# Altium schematic sheet STAC_Test_Board_v1_QSPI.SchDoc: STAC Quad-SPI Peripherals
size B; DrawnBy: Rahul Kumar; Revision: X1; SheetNumber: 4; SheetTotal: 5
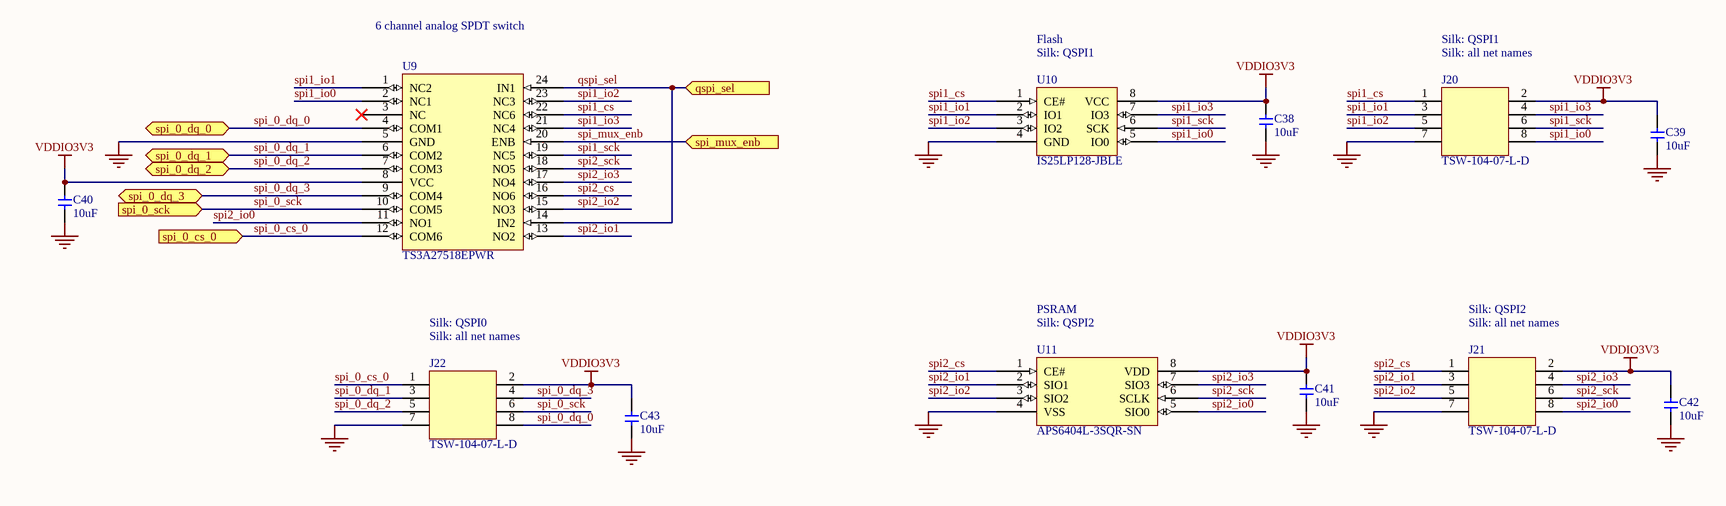
[diagram p0: STAC_Test_Board_v1_QSPI.SchDoc]

## Parts
C38  10uF  [0603]
C39  10uF  [0603]
C40  10uF  [0603]
C41  10uF  [0603]
C42  10uF  [0603]
C43  10uF  [0603]
J20  TSW-104-07-L-D  [CON-008-100-400X200/2X4-POST]
J21  TSW-104-07-L-D  [CON-008-100-400X200/2X4-POST]
J22  TSW-104-07-L-D  [CON-008-100-400X200/2X4-POST]
U9  TS3A27518EPWR  [GW-24-.65-6.4]
U10  IS25LP128-JBLE  [GW-08-1.27-5.2X8.0]
U11  APS6404L-3SQR-SN  [GW-08-1.27-5.0X6.0]

## Ports
qspi_sel (in, see STAC_Test_Board_v1[3C], STAC_Test_Board_v1_SwitchesButtons[6C]), spi_0_cs_0 (in, see STAC_Test_Board_v1[3C]), spi_0_dq_0 (bidir, see STAC_Test_Board_v1[3C]), spi_0_dq_1 (bidir, see STAC_Test_Board_v1[3C]), spi_0_dq_2 (bidir, see STAC_Test_Board_v1[3C]), spi_0_dq_3 (bidir, see STAC_Test_Board_v1[3C]), spi_0_sck (in, see STAC_Test_Board_v1[3C]), spi_mux_enb (in, see STAC_Test_Board_v1[3C], STAC_Test_Board_v1_SwitchesButtons[6C])

## Nets
GND: C38.2 C39.2 C40.2 C41.2 C42.2 C43.2 J20.7 J21.7 J22.7 U9.5(GND) U10.4(GND) U11.4(VSS)
VDDIO3V3: C38.1 C39.1 C40.1 C41.1 C42.1 C43.1 J20.2 J21.2 J22.2 U9.8(VCC) U10.8(VCC) U11.8(VDD)
qspi_sel: U9.14(IN2) U9.24(IN1) ; port qspi_sel
spi1_cs: J20.1 U9.22(NC6) U10.1(CE#)
spi1_io0: J20.8 U9.2(NC1) U10.5(IO0)
spi1_io1: J20.3 U9.1(NC2) U10.2(IO1)
spi1_io2: J20.5 U9.23(NC3) U10.3(IO2)
spi1_io3: J20.4 U9.21(NC4) U10.7(IO3)
spi1_sck: J20.6 U9.19(NC5) U10.6(SCK)
spi2_cs: J21.1 U9.16(NO6) U11.1(CE#)
spi2_io0: J21.8 U9.11(NO1) U11.5(SIO0)
spi2_io1: J21.3 U9.13(NO2) U11.2(SIO1)
spi2_io2: J21.5 U9.15(NO3) U11.3(SIO2)
spi2_io3: J21.4 U9.17(NO4) U11.7(SIO3)
spi2_sck: J21.6 U9.18(NO5) U11.6(SCLK)
spi_0_cs_0: J22.1 U9.12(COM6) ; port spi_0_cs_0
spi_0_dq_0: J22.8 U9.4(COM1) ; port spi_0_dq_0
spi_0_dq_1: J22.3 U9.6(COM2) ; port spi_0_dq_1
spi_0_dq_2: J22.5 U9.7(COM3) ; port spi_0_dq_2
spi_0_dq_3: J22.4 U9.9(COM4) ; port spi_0_dq_3
spi_0_sck: J22.6 U9.10(COM5) ; port spi_0_sck
spi_mux_enb: U9.20(ENB) ; port spi_mux_enb

Not connected (* = marked no-connect by the designer): U9 3(NC)*

## Notes on the sheet
- 6 channel analog SPDT switch
- Flash
- (near U10) Silk: QSPI1
- Silk: QSPI1
- (near J20) Silk: all net names
- Silk: QSPI0
- PSRAM
- (near U11) Silk: QSPI2
- Silk: QSPI2
- (near J21) Silk: all net names
- (near J22) Silk: all net names

## Library data of the parts
C38-C43 = DISCRETE_C: Capacitor generic
J20-J22 = CON_008pin_2x4: Con 8 pins 2x4
U9 = IC_TS3A27518EPWR: Analog switch SPDT 6 channels bidirectional
U10 = IC_IS25LP128: Flash memory 128Mb with 133MHz QSPI
U11 = IC_APS6404L: PSRAM 64Mb with 84-133MHz QSPI, 1024 byte pages